# Altium schematic sheet [4] PowerManagement.SchDoc: =DocumentName
size A3; Organization: ORGANIZATION; Address1: R. Aprígio Veloso, 882, Universitário; Address2: Campina Grande - PB; Address3: 58429-900; DocumentNumber: 4; Revision: -; SheetNumber: 4; SheetTotal: 8; ENG_DATE: --/--/--; DSN_DATE: --/--/--; CHK_DATE: --/--/--; SCH_SCALE: 1:1
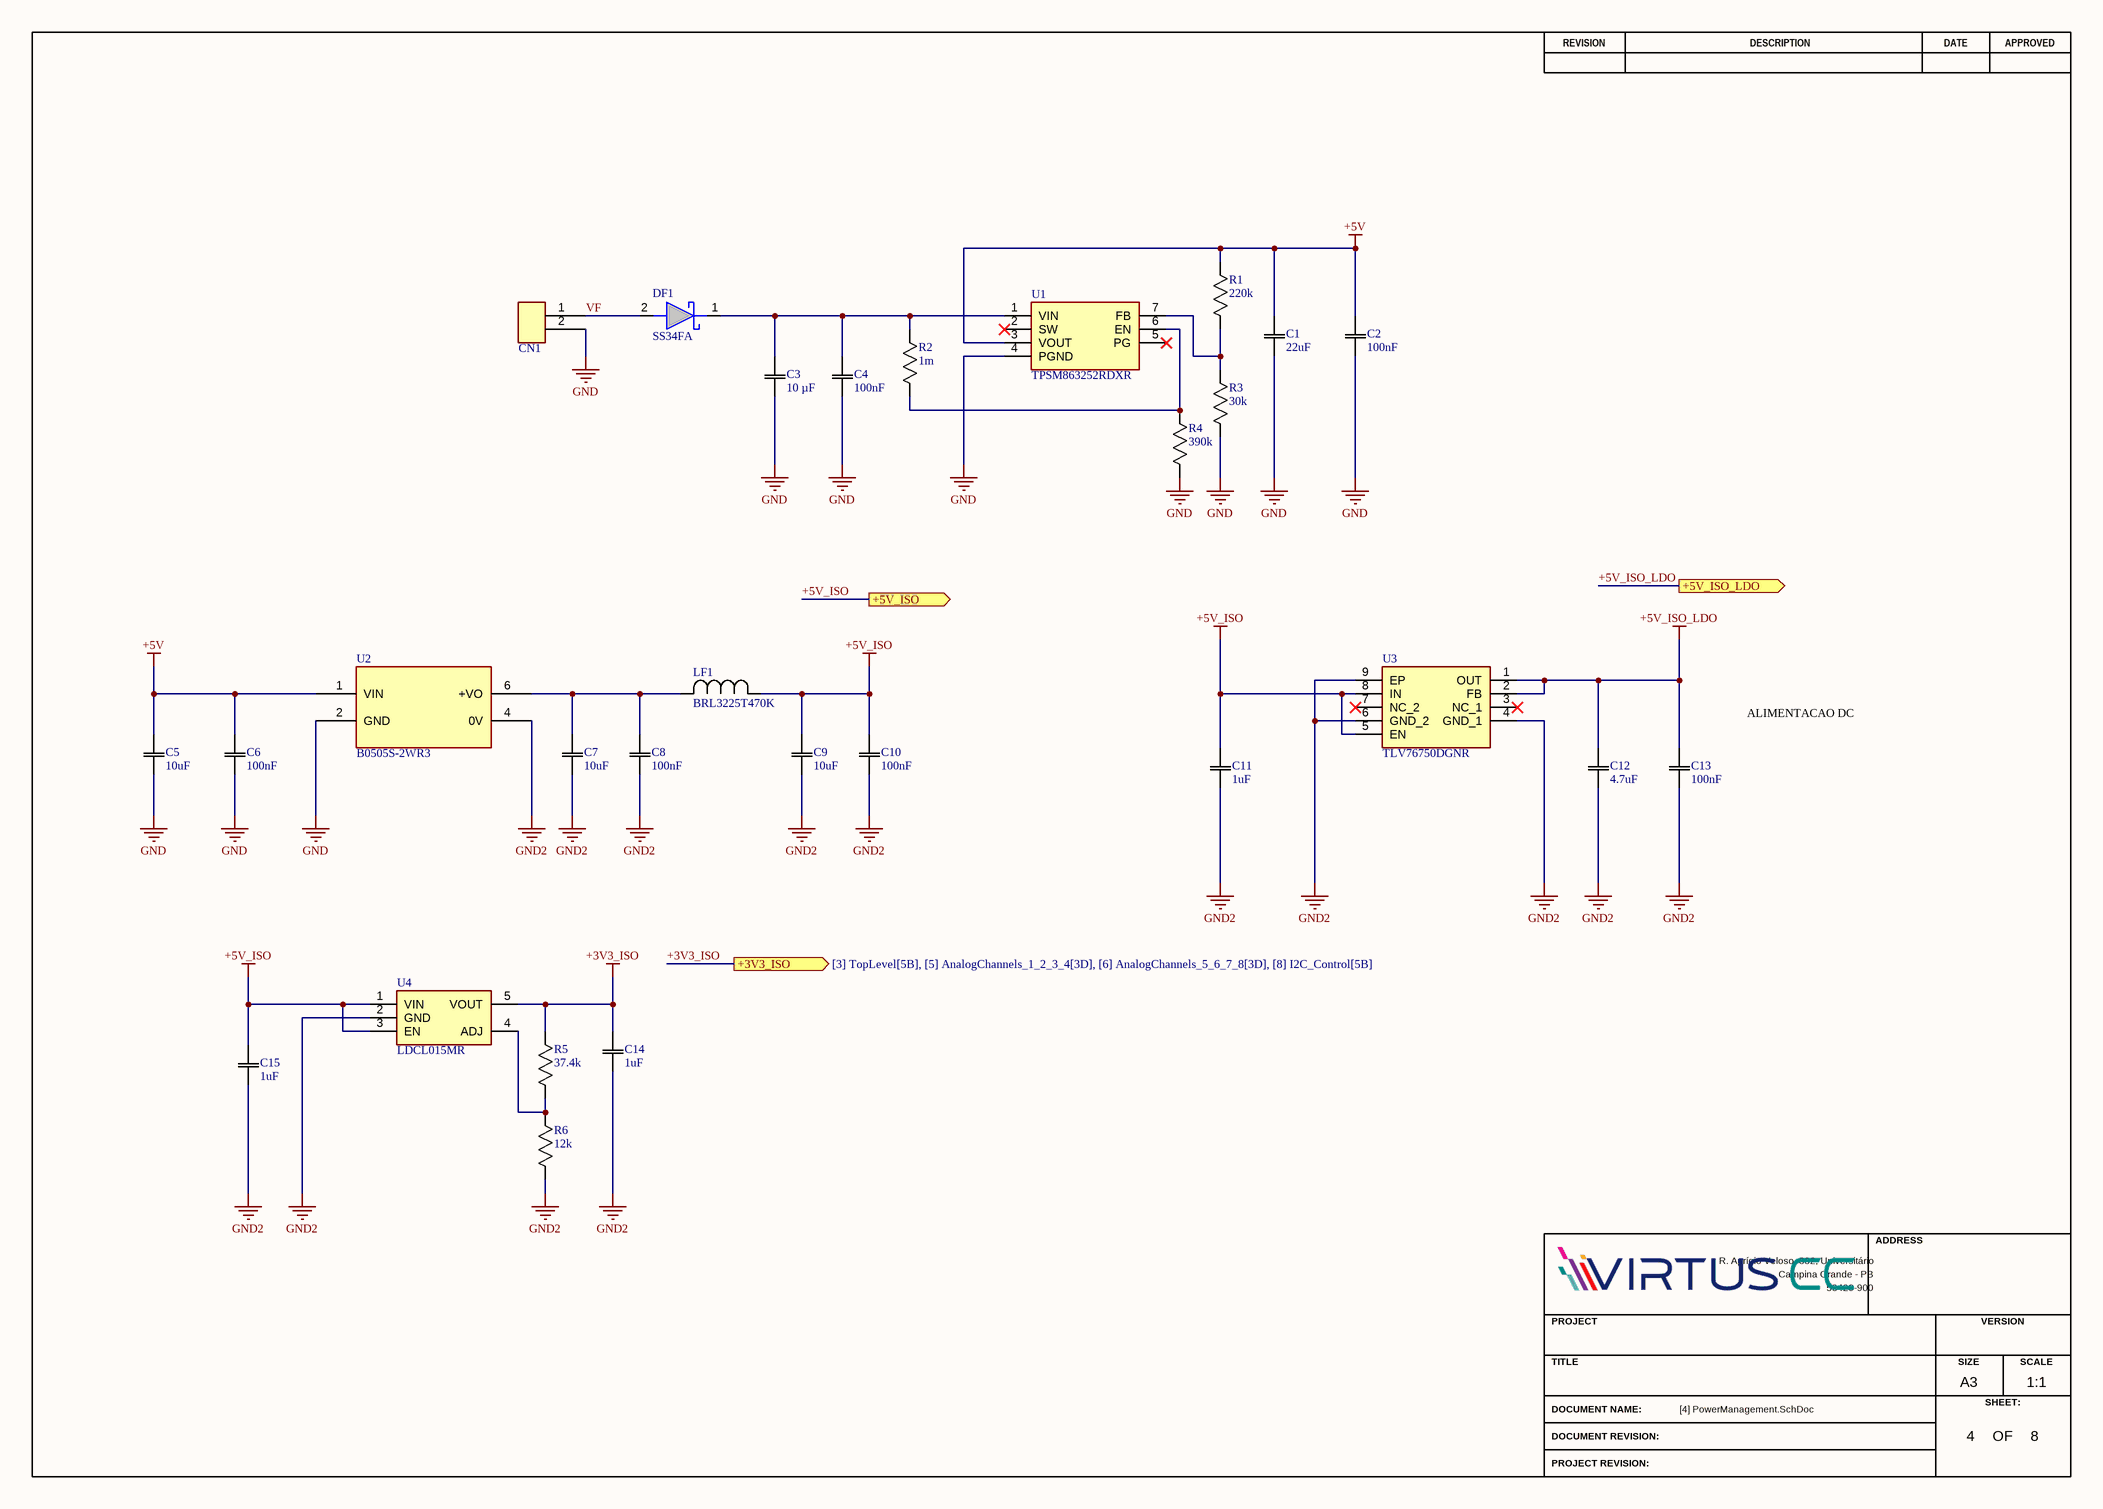
[diagram p0: [4] PowerManagement.SchDoc]

## Parts
C1  value 22uF  [CAPC1608X06N]  (hidden comment: CL10A226MO7JZNC)
C2  value 100nF  [CAPC1005X40N]  (hidden comment: GCM155R71H104KE02D)
C3  value 10 µF  [CAPC1608X06N]  (hidden comment: CL10A106MA8NRNC)
C4  value 100nF  [CAPC1005X40N]  (hidden comment: GCM155R71H104KE02D)
C5  value 10uF  [CAPC1005X40N]  (hidden comment: GRT155R61A106ME13D)
C6  value 100nF  [CAPC1005X40N]  (hidden comment: GCM155R71H104KE02D)
C7  value 10uF  [CAPC1005X40N]  (hidden comment: GRT155R61A106ME13D)
C8  value 100nF  [CAPC1005X40N]  (hidden comment: GCM155R71H104KE02D)
C9  value 10uF  [CAPC1005X40N]  (hidden comment: GRT155R61A106ME13D)
C10  value 100nF  [CAPC1005X40N]  (hidden comment: GCM155R71H104KE02D)
C11  value 1uF  [CAPC1005X40N]  (hidden comment: GRM155Z71A105KE01D)
C12  value 4.7uF  [CAPC1005X40N]  (hidden comment: GRM155R61A475MEAAD)
C13  value 100nF  [CAPC1005X40N]  (hidden comment: GCM155R71H104KE02D)
C14  value 1uF  [CAPC1005X40N]  (hidden comment: GRM155Z71A105KE01D)
C15  value 1uF  [CAPC1005X40N]  (hidden comment: GRM155Z71A105KE01D)
CN1  JDCN2.0  [JACK - P4]  (value not drawn)
DF1  SS34FA  [SODFL3618X143N]
LF1  BRL3225T470K  [IND_TAIYO_BRL3225_TAY]
R1  value 220k  [RESC1005X40N]  (hidden comment: RC0402FR-07220KL)
R2  value 1m  [RESC1005X40N]  (hidden comment: RC0402FR-071ML)
R3  value 30k  [RESC1005X40N]  (hidden comment: RC0402FR-0730KL)
R4  value 390k  [RESC1005X40N]  (hidden comment: RC0402FR-07390KL)
R5  value 37.4k  [RESC1005X40N]  (hidden comment: RC0402FR-0737K4L)
R6  value 12k  [RESC1005X40N]  (hidden comment: RC0402FR-0712KL)
U1  TPSM863252RDXR  [RDX0007A-MFG - 2]
U2  B0505S-2WR3  [B_S-2WR2_MNS]
U3  TLV76750DGNR  [VSSOP_0DGNR_TEX]
U4  LDCL015MR  [SOT95P280X145-5N]

## Ports
+3V3_ISO (out, see [3] TopLevel[5B], [5] AnalogChannels_1_2_3_4[3D], [6] AnalogChannels_5_6_7_8[3D], [8] I2C_Control[5B]), +5V_ISO (out, see [3] TopLevel[5B], [5] AnalogChannels_1_2_3_4[3D], [6] AnalogChannels_5_6_7_8[3D]), +5V_ISO_LDO (out, see [3] TopLevel[5B], [7] ADC_Acquisition[3B])

## Nets
+3V3_ISO: C14.2 R5.1 U4.5(VOUT) ; port +3V3_ISO
+5V: C1.2 C2.2 C5.2 C6.2 R1.1 U1.3(VOUT) U2.1(VIN)
+5V_ISO: C9.2 C10.2 C11.2 C15.2 LF1.1 U3.5(EN) U3.8(IN) U4.1(VIN) U4.3(EN) ; port +5V_ISO
+5V_ISO_LDO: C12.2 C13.2 U3.1(OUT) U3.2(FB) ; port +5V_ISO_LDO
GND: C1.1 C2.1 C3.1 C4.1 C5.1 C6.1 CN1.2 R3.2 R4.2 U1.4(PGND) U2.2(GND)
GND2: C7.1 C8.1 C9.1 C10.1 C11.1 C12.1 C13.1 C14.1 C15.1 R6.2 U2.4(0V) U3.4(GND_1) U3.6(GND_2) U3.9(EP) U4.2(GND)
VF: CN1.1 DF1.2(A)
NetC3_2: C3.2 C4.2 DF1.1(K) R2.1 U1.1(VIN)
NetC7_2: C7.2 C8.2 LF1.2 U2.6(+VO)
NetR1_2: R1.2 R3.1 U1.7(FB)
NetR2_2: R2.2 R4.1 U1.6(EN)
NetR5_2: R5.2 R6.1 U4.4(ADJ)

Not connected (* = marked no-connect by the designer): U1 2(SW)* 5(PG)*; U3 3(NC_1)* 7(NC_2)*

## Notes on the sheet
- ALIMENTACAO DC
- REVISION
- DESCRIPTION
- DATE
- APPROVED
- ADDRESS
- PROJECT
- VERSION
- TITLE
- A3
- SIZE
- SCALE
- DOCUMENT NAME:
- DOCUMENT REVISION:
- OF
- SHEET:
- PROJECT REVISION:

## Library data of the parts
C1 = CL10A226MO7JZNC: 22 µF ±20% 16V Ceramic Capacitor X5R 0603 (1608 Metric); Manufacturer_Name: Samsung; Copyright: Copyright (C) 2026 Ultra Librarian. All rights reserved.; Manufacturer_Part_Number: CL10A226MO7JZNC; Supplier 1: DigiKey; Supplier Part Number 1: 1276-7076-1-ND; Datasheet Link: https://mm.digikey.com/Volume0/opasdata/d220001/medias/docus/2139/CL10A226MO7JZNC_Spec.pdf
C2 C4 C6 C8 C10 C13 = GCM155R71H104KE02D: 0.1 µF ±10% 50V Ceramic Capacitor X7R 0402 (1005 Metric); Manufacturer_Name: Murata; Copyright: Copyright (C) 2026 Ultra Librarian. All rights reserved.; Manufacturer_Part_Number: GCM155R71H104KE02D; Supplier 1: DigiKey; Supplier Part Number 1: 490-10672-1-ND; Datasheet Link: https://search.murata.co.jp/Ceramy/image/img/A01X/G101/ENG/GCM155R71H104KE02-01.pdf
C3 = CL10A106MA8NRNC: 10 µF ±20% 25V Ceramic Capacitor X5R 0603 (1608 Metric); Manufacturer_Name: Samsung; Copyright: Copyright (C) 2025 Ultra Librarian. All rights reserved.; Manufacturer_Part_Number: CL10A106MA8NRNC; Supplier 1: DigiKey; Supplier Part Number 1: 1276-1869-1-ND; Datasheet Link: https://mm.digikey.com/Volume0/opasdata/d220001/medias/docus/658/CL10A106MA8NRNC_Spec.pdf
C5 C7 C9 = GRT155R61A106ME13D: 10 µF ±20% 10V Ceramic Capacitor X5R 0402 (1005 Metric); Manufacturer_Name: Murata; Copyright: Copyright (C) 2026 Ultra Librarian. All rights reserved.; Manufacturer_Part_Number: GRT155R61A106ME13D; Supplier 1: DigiKey; Supplier Part Number 1: 490-GRT155R61A106ME13DCT-ND; Datasheet Link: https://search.murata.co.jp/Ceramy/image/img/A01X/G101/ENG/GRT155R61A106ME13-01A.pdf
C11 C14 C15 = GRM155Z71A105KE01D: 1 µF ±10% 10V Ceramic Capacitor X7R 0402 (1005 Metric); Manufacturer_Name: Murata; Copyright: Copyright (C) 2025 Ultra Librarian. All rights reserved.; Manufacturer_Part_Number: GRM155Z71A105KE01D; Supplier 1: DigiKey; Supplier Part Number 1: 490-GRM155Z71A105KE01DCT-ND
C12 = GRM155R61A475MEAAD: 4.7 µF ±20% 10V Ceramic Capacitor X5R 0402 (1005 Metric); Manufacturer_Name: Murata; Copyright: Copyright (C) 2025 Ultra Librarian. All rights reserved.; Manufacturer_Part_Number: GRM155R61A475MEAAD; Supplier 1: DigiKey; Supplier Part Number 1: 490-14306-1-ND
CN1 = JDCN2.0: Conector Fonte. JDCN2.0; Manufacturer: *; Datasheet 1: *; Supplier Link 1: *; Package: *; Price 1: *; Value: *; Supplier 1: *; Manufacturer Part Number: *; Supplier Part Number 1: *; Supplier 2: DigiKey; Supplier Part Number 2: CP-037A-ND; Supplier Link 2: *; Price 2: *; Datasheet 2: *
DF1 = SS34FA: UL Flammability 94V-0 Classification; MSL 1 per J-STD-020; Low Power Loss, High Efficiency; Guard Ring for Overvoltage Protection; RoHS Compliant / Green Molding Compound; High Surge Current Capability; NRVB Prefix for Automotive and Other Applications Requiring Unique Site and Control Change Requirements; AECQ101 Qualified and PPAP Capable; Manufacturer_Name: onsemi; Geometry.Height: 1.43mm; Manufacturer_Part_Number: SS34FA; Mouser Part Number: 512-SS34FA; Mouser Price/Stock: https://www.mouser.co.uk/ProductDetail/onsemi-Fairchild/SS34FA?qs=R26iFe%2FkX%2FK1QUwZdCmBBw%3D%3D; Arrow Part Number: SS34FA; Arrow Price/Stock: https://www.arrow.com/en/products/ss34fa/on-semiconductor?utm_currency=USD&region=nac; Datasheet Link: https://www.onsemi.com/pub/Collateral/SS36FA-D.PDF
LF1 = BRL3225T470K: 47 µH Semi-Shielded Drum Core, Wirewound Inductor 390 mA 1.2Ohm Max 1210 (3225 Metric); Manufacturer_Name: TAIYO YUDEN; Value: 47uF; Copyright: Copyright (C) 2025 Ultra Librarian. All rights reserved.; Manufacturer_Part_Number: BRL3225T470K; Supplier 1: DigiKey; Supplier Part Number 1: 587-2169-1-ND; Datasheet Link: https://mm.digikey.com/Volume0/opasdata/d220001/medias/docus/610/BRL3225T470K_SS.pdf
R1 = RC0402FR-07220KL: 220 kOhms ±1% 0.063W, 1/16W Chip Resistor 0402 (1005 Metric) Moisture Resistant Thick Film; Manufacturer_Name: Yageo; Copyright: Copyright (C) 2026 Ultra Librarian. All rights reserved.; Manufacturer_Part_Number: RC0402FR-07220KL; Supplier 1: DigiKey; Supplier Part Number 1: 311-220KLRCT-ND; Datasheet Link: https://yageogroup.com/content/datasheet/asset/file/PYU-RC_GROUP_51_ROHS_L
R2 = RC0402FR-071ML: 1 MOhms ±1% 0.063W, 1/16W Chip Resistor 0402 (1005 Metric) Moisture Resistant Thick Film; Manufacturer_Name: Yageo; Copyright: Copyright (C) 2026 Ultra Librarian. All rights reserved.; Manufacturer_Part_Number: RC0402FR-071ML; Supplier 1: DigiKey; Supplier Part Number 1: 311-1.00MLRCT-ND; Datasheet Link: https://yageogroup.com/content/datasheet/asset/file/PYU-RC_GROUP_51_ROHS_L
R3 = RC0402FR-0730KL: 30 kOhms ±1% 0.063W, 1/16W Chip Resistor 0402 (1005 Metric) Moisture Resistant Thick Film; Manufacturer_Name: Yageo; Copyright: Copyright (C) 2026 Ultra Librarian. All rights reserved.; Manufacturer_Part_Number: RC0402FR-0730KL; Supplier 1: DigiKey; Supplier Part Number 1: 311-30.0KLRCT-ND; Datasheet Link: https://yageogroup.com/content/datasheet/asset/file/PYU-RC_GROUP_51_ROHS_L
R4 = RC0402FR-07390KL: 390 kOhms ±1% 0.063W, 1/16W Chip Resistor 0402 (1005 Metric) Moisture Resistant Thick Film; Manufacturer_Name: Yageo; Copyright: Copyright (C) 2026 Ultra Librarian. All rights reserved.; Manufacturer_Part_Number: RC0402FR-07390KL; Supplier 1: DigiKey; Supplier Part Number 1: YAG3143CT-ND; Datasheet Link: https://yageogroup.com/content/datasheet/asset/file/PYU-RC_GROUP_51_ROHS_L
R5 = RC0402FR-0737K4L: 37.4 kOhms ±1% 0.063W, 1/16W Chip Resistor 0402 (1005 Metric) Moisture Resistant Thick Film; Manufacturer_Name: Yageo; Copyright: Copyright (C) 2026 Ultra Librarian. All rights reserved.; Manufacturer_Part_Number: RC0402FR-0737K4L; Supplier 1: DigiKey; Supplier Part Number 1: YAG3138CT-ND; Datasheet Link: https://yageogroup.com/content/datasheet/asset/file/PYU-RC_GROUP_51_ROHS_L
R6 = RC0402FR-0712KL: 12 kOhms ±1% 0.063W, 1/16W Chip Resistor 0402 (1005 Metric) Moisture Resistant Thick Film; Manufacturer_Name: Yageo; Copyright: Copyright (C) 2025 Ultra Librarian. All rights reserved.; Manufacturer_Part_Number: RC0402FR-0712KL; Supplier: Digikey; Supplier Part Number 1: 311-12.0KLRCT-ND; Supplier 1: Digikey; Datasheet Link: https://yageogroup.com/content/datasheet/asset/file/PYU-RC_GROUP_51_ROHS_L
U1 = TPSM863252RDXR: 3-V to 17-V input voltage, 3-A Eco-mode synchronous buck module 7-QFN-FCMOD -40 to 125; Manufacturer_Name: Texas Instruments; TYPE: TYPE; RefDes: RefDes; Copyright: Copyright (C) 2025 Ultra Librarian. All rights reserved.; Manufacturer_Part_Number: TPSM863252RDXR; Supplier: Digikey; Supplier 1: DigiKey; Supplier Part Number 1: 296-TPSM863252RDXRCT-ND; Value: TPSM863252RDXR; Parameter 2: *
U2 = B0505S-2WR3: Isolated Module DC DC Converter 1 Output 5V 400mA 4.5V - 5.5V Input; Manufacturer_Name: MORNSUN; Type: DC DC Converters; Copyright: Copyright (C) 2026 Ultra Librarian. All rights reserved.; Manufacturer_Part_Number: B0505S-2WR3; RefDes: RefDes; Supplier 1: Digikey; Supplier Part Number 1: 2725-B0505S-2WR3-ND; Value: B0505S-2WR3; Datasheet Link: https://www.mornsun-power.com/html/pdf/B0505S-2WR3.html
U3 = TLV76750DGNR: LDO Voltage Regulators Adjustable- and fixed-output, 1-A, 16-V, positive-voltage low-dropout (LDO) linear regulator 8-HVSSOP -40 to 125; Manufacturer_Name: Texas Instruments; Geometry.Height: 1.1mm; Manufacturer_Part_Number: TLV76750DGNR; Mouser Part Number: 595-TLV76750DGNR; Mouser Price/Stock: https://www.mouser.co.uk/ProductDetail/Texas-Instruments/TLV76750DGNR?qs=QNEnbhJQKvaJEVkWGWZhnw%3D%3D; Arrow Part Number: *; Arrow Price/Stock: *; Datasheet Link: https://www.ti.com/lit/gpn/tlv767
U4 = LDCL015MR: Linear Voltage Regulator IC Positive Adjustable 1 Output 150mA SOT-23-5; Manufacturer_Name: STMicroelectronics; Parameter 1: 497-12085-1-ND; Datasheet Link: https://www.st.com/resource/en/datasheet/ldcl015.pdf; Height: 1.45mm; Manufacturer_Part_Number: LDCL015MR; Mouser Part Number: 511-LDCL015MR; Mouser Price/Stock: https://www.mouser.co.uk/ProductDetail/STMicroelectronics/LDCL015MR?qs=GkDVaEP5dcuyqQ8OoCXIYg%3D%3D; Arrow Part Number: LDCL015MR; Arrow Price/Stock: https://www.arrow.com/en/products/ldcl015mr/stmicroelectronics?region=nac; Supplier 1: Digikey; Value: LDCL015MR